# EAGLE design PCB (EAGLE 9.6.2)
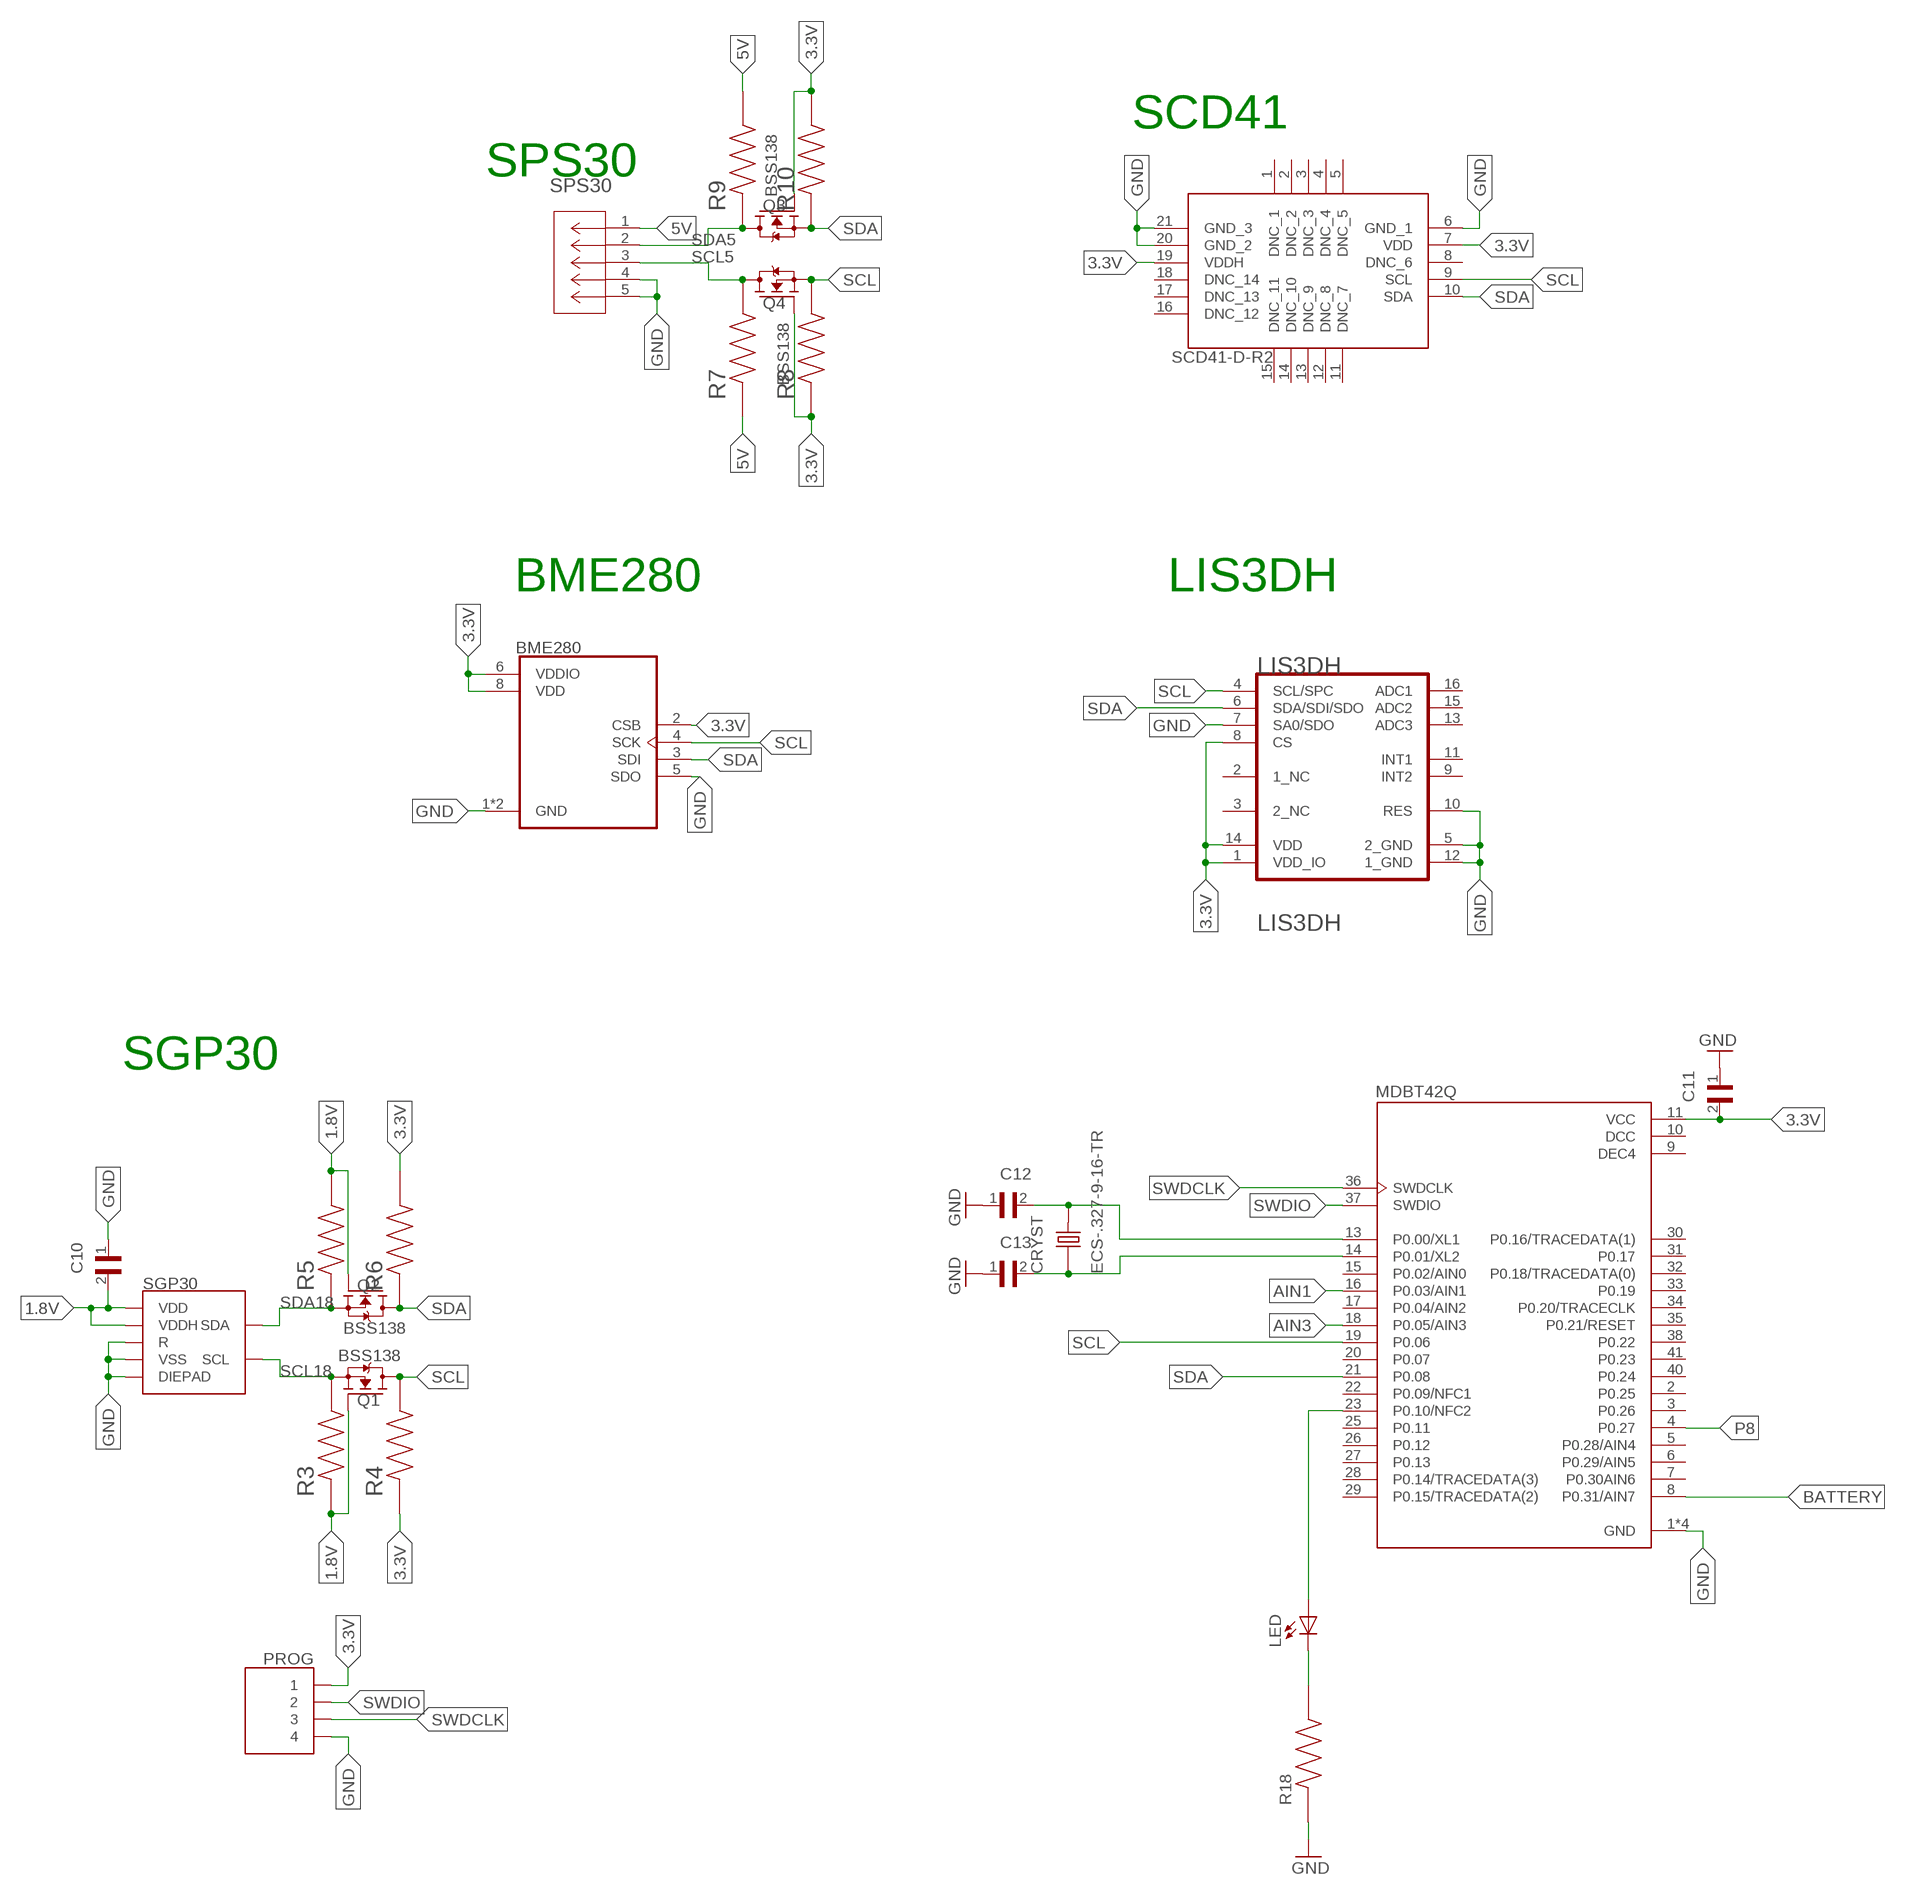
[diagram p0: schematic, sheet 1, part 1 of 2]
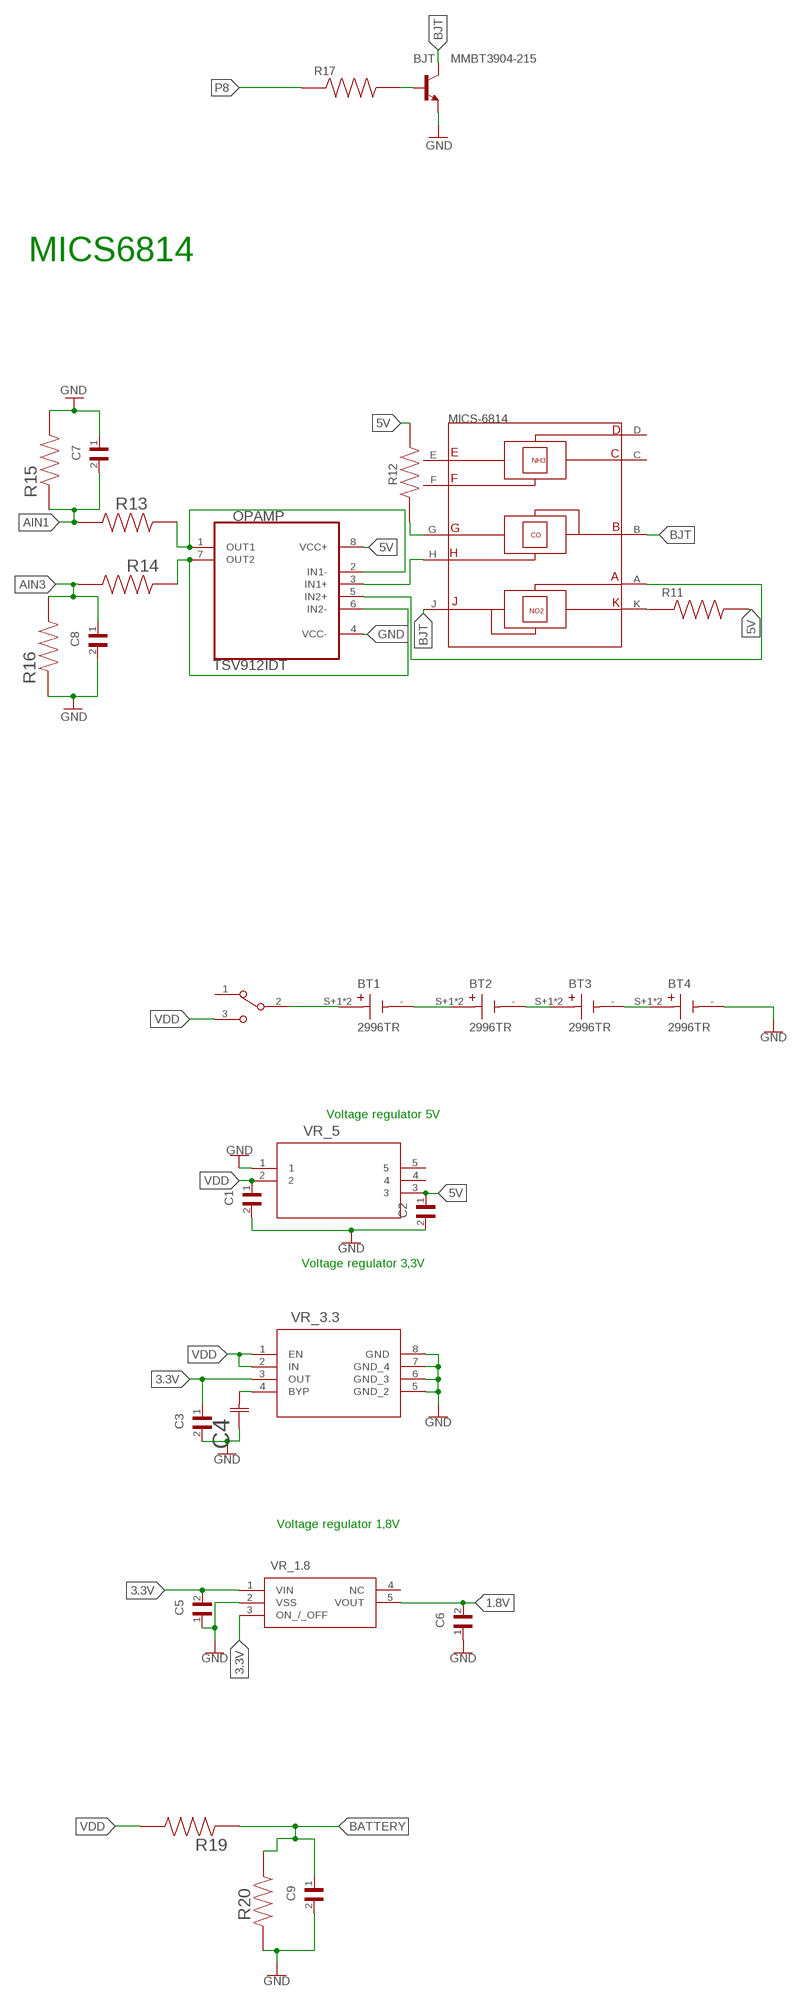
[diagram p1: schematic, sheet 1, part 2 of 2]

## Parts
BJT  MMBT3904-215  [SOT95P230X110-3N]
BME280  BME280  [PSON65P250X250X100-8N]
BT1  2996TR  [BAT_2996TR]
BT2  2996TR  [BAT_2996TR]
BT3  2996TR  [BAT_2996TR]
BT4  2996TR  [BAT_2996TR]
C1  C0402C104K9RACAUTO  [CAPC1005X55N]
C2  C0402C104K9RACAUTO  [CAPC1005X55N]
C3  CL05A225MQ5NNNC  [CAPC1005X55N]
C4  CL05B471KB5NNNCCAP_CL05_SAM  [CAP_CL05_SAM]
C5  JMK105BJ105KV-F  [CAPC1005X55N]
C6  JMK105BJ105KV-F  [CAPC1005X55N]
C7  CL05B103KO5NNNC  [CAPC1005X55N]
C8  CL05B103KO5NNNC  [CAPC1005X55N]
C9  CL05B103KO5NNNC  [CAPC1005X55N]
C10  C0402C104K9RACAUTO  [CAPC1005X55N]
C11  CL05A106MP5NUNC  [CAPC1005X55N]
C12  04025A120FAT2A  [CAPC1005X56N]
C13  04025A120FAT2A  [CAPC1005X56N]
CRYST  ECS-.327-9-16-TR  [XTAL_ECS-.327-9-16-TR]
LED  LTST-C170KRKT  [DIOC200X125X110]
LIS3DH  STMICROELECTRONICS_LIS3DHSTMICROELECTRONICS_LIS3DH_0_0  [STMICROELECTRONICS_LIS3DH_0]
MDBT42Q  317030213  [XCVR_317030213]
MICS6814  MICS-6814  [SENSOR_MICS-6814]
OPAMP  TSV912IDT  [SOIC127P600X175-8N]
PROG  BG306-04-A-1-0400-X-X_REVD  [GCT_BG306-04-A-1-0400-X-X_REVD]
Q1  BSS138  [SOT95P240X111-3N]
Q2  BSS138  [SOT95P240X111-3N]
Q3  BSS138  [SOT95P240X111-3N]
Q4  BSS138  [SOT95P240X111-3N]
R3  MCS0402MC1002FE000  [RESC1005X37N]
R4  MCS0402MC1002FE000  [RESC1005X37N]
R5  MCS0402MC1002FE000  [RESC1005X37N]
R6  MCS0402MC1002FE000  [RESC1005X37N]
R7  MCS0402MC1002FE000  [RESC1005X37N]
R8  MCS0402MC1002FE000  [RESC1005X37N]
R9  MCS0402MC1002FE000  [RESC1005X37N]
R10  MCS0402MC1002FE000  [RESC1005X37N]
R11  ERJPA2F1300X  [RES_ERJPA2F1300X]
R12  ERJPA2J821X  [RES_ERJPA2J821X]
R13  ERJ-2GEJ515X  [RESC1005X40N]
R14  ERJ-2GEJ515X  [RESC1005X40N]
R15  ERJ-2GEJ106X  [RESC1005X40N]
R16  ERJ-2GEJ106X  [RESC1005X40N]
R17  ERJPA2F5101X  [RES_ERJPA2F5101X]
R18  ERA2AEB331X  [RES_ERA2AEB331X]
R19  ERJ-2GEJ106X  [RESC1005X40N]
R20  ERJ-2GEJ106X  [RESC1005X40N]
S1  EG1213  [SW_EG1213]
SCD41  SCD41-D-R2  [SCD41DR2]
SGP30  SGP30  [SGP30]
SPS30  S5B-ZR-SM4A-TF_(LF)_(SN)CONN_S5B-ZR-SM4A-TF_JST  [CONN_S5B-ZR-SM4A-TF_JST]
VR_1.8  S-1318D18-M5T1U4  [SOT95P275X130-5N]
VR_3.3  MIC5219-3.3YMMMSOP-8LD-PL-1_MCH  [MSOP-8LD-PL-1_MCH]
VR_5  MC78LC50NTRGTSOT23-5_ONS  [TSOT23-5_ONS]

## Nets
1.8V: C6.2 C10.2 Q1.1(G) Q2.1(G) R3.1 R5.2 SGP30.1(VDD) SGP30.5(VDDH) VR_1.8.5(VOUT)
3.3V: BME280.2(CSB) BME280.6(VDDIO) BME280.8(VDD) C3.1 C5.2 C11.2 LIS3DH.1(VDD_IO) LIS3DH.8(CS) LIS3DH.14(VDD) MDBT42Q.11(VCC) PROG.1 Q3.1(G) Q4.1(G) R4.1 R6.2 R8.1 R10.2 SCD41.7(VDD) SCD41.19(VDDH) VR_1.8.1(VIN) VR_1.8.3(ON_/_OFF) VR_3.3.3(OUT)
5V: C2.1 OPAMP.8(VCC+) R7.1 R9.2 R11.2 R12.2 SPS30.1 VR_5.3
AIN1: C7.2 MDBT42Q.16(P0.03/AIN1) R13.1 R15.1
AIN3: C8.1 MDBT42Q.18(P0.05/AIN3) R14.1 R16.2
BATTERY: C9.1 MDBT42Q.8(P0.31/AIN7) R19.1 R20.1
BJT: BJT.3(C) MICS6814.B(RH1/RS1_RED) MICS6814.J(RH1/RS1_OX)
GND: BJT.2(E) BME280.1(GND) BME280.5(SDO) BME280.7(GND) BT4.- C1.2 C2.2 C3.2 C4.1 C5.1 C6.1 C7.1 C8.2 C9.2 C10.1 C11.1 C12.1 C13.1 LIS3DH.5(2_GND) LIS3DH.7(SA0/SDO) LIS3DH.10(RES) LIS3DH.12(1_GND) MDBT42Q.1(GND) MDBT42Q.12(GND) MDBT42Q.24(GND) MDBT42Q.39(GND) OPAMP.4(VCC-) PROG.4 R15.2 R16.1 R18.1 R20.2 SCD41.6(GND_1) SCD41.20(GND_2) SCD41.21(GND_3) SGP30.2(VSS) SGP30.4(R) SGP30.DIEPAD SPS30.4 SPS30.5 VR_1.8.2(VSS) VR_3.3.5(GND_2) VR_3.3.6(GND_3) VR_3.3.7(GND_4) VR_3.3.8(GND) VR_5.1
LED: LED.+ MDBT42Q.23(P0.10/NFC2)
N$2: BT1.- BT2.S+1(+) BT2.S+2(+)
N$3: MICS6814.A(RS2) OPAMP.5(IN2+)
N$4: BT2.- BT3.S+1(+) BT3.S+2(+)
N$7: OPAMP.6(IN2-) OPAMP.7(OUT2) R14.2
N$8: OPAMP.1(OUT1) OPAMP.2(IN1-) R13.2
N$9: LED.- R18.2
N$10: MICS6814.H(RS2_RED) OPAMP.3(IN1+)
N$11: MICS6814.G(RH2_RED) R12.1
N$13: MICS6814.K(RH2_OX) R11.1
N$14: C4.2 VR_3.3.4(BYP)
N$15: BJT.1(B) R17.2
N$17: C12.2 CRYST.2 MDBT42Q.13(P0.00/XL1)
N$18: C13.2 CRYST.1 MDBT42Q.14(P0.01/XL2)
N$25: BT3.- BT4.S+1(+) BT4.S+2(+)
N$27: BT1.S+1(+) BT1.S+2(+) S1.2
P8: MDBT42Q.4(P0.27) R17.1
SCL: BME280.4(SCK) LIS3DH.4(SCL/SPC) MDBT42Q.19(P0.06) Q1.3(D) Q4.2(S) R4.2 R8.2 SCD41.9(SCL)
SCL5: Q4.3(D) R7.2 SPS30.3
SCL18: Q1.2(S) R3.2 SGP30.6(SCL)
SDA: BME280.3(SDI) LIS3DH.6(SDA/SDI/SDO) MDBT42Q.21(P0.08) Q2.3(D) Q3.2(S) R6.1 R10.1 SCD41.10(SDA)
SDA5: Q3.3(D) R9.1 SPS30.2
SDA18: Q2.2(S) R5.1 SGP30.3(SDA)
SWDCLK: MDBT42Q.36(SWDCLK) PROG.3
SWDIO: MDBT42Q.37(SWDIO) PROG.2
VDD: C1.1 R19.2 S1.3 VR_3.3.1(EN) VR_3.3.2(IN) VR_5.2
Unconnected: LIS3DH.2(1_NC) LIS3DH.3(2_NC) LIS3DH.9(INT2) LIS3DH.11(INT1) LIS3DH.13(ADC3) LIS3DH.15(ADC2) LIS3DH.16(ADC1) MDBT42Q.2(P0.25) MDBT42Q.3(P0.26) MDBT42Q.5(P0.28/AIN4) MDBT42Q.6(P0.29/AIN5) MDBT42Q.7(P0.30AIN6) MDBT42Q.15(P0.02/AIN0) MDBT42Q.17(P0.04/AIN2) MDBT42Q.20(P0.07) MDBT42Q.22(P0.09/NFC1) MDBT42Q.25(P0.11) MDBT42Q.26(P0.12) MDBT42Q.27(P0.13) MDBT42Q.28(P0.14/TRACEDATA(3)) MDBT42Q.29(P0.15/TRACEDATA(2)) MDBT42Q.30(P0.16/TRACEDATA(1)) MDBT42Q.31(P0.17) MDBT42Q.32(P0.18/TRACEDATA(0)) MDBT42Q.33(P0.19) MDBT42Q.34(P0.20/TRACECLK) MDBT42Q.35(P0.21/RESET) MDBT42Q.38(P0.22) MDBT42Q.40(P0.24) MDBT42Q.41(P0.23) MICS6814.C(RH1_NH3) MICS6814.D(RS1_NH3) MICS6814.E(RH2_NH3) MICS6814.F(RS2_NH3) S1.1 SCD41.1(DNC_1) SCD41.2(DNC_2) SCD41.3(DNC_3) SCD41.4(DNC_4) SCD41.5(DNC_5) SCD41.8(DNC_6) SCD41.11(DNC_7) SCD41.12(DNC_8) SCD41.13(DNC_9) SCD41.14(DNC_10) SCD41.15(DNC_11) SCD41.16(DNC_12) SCD41.17(DNC_13) SCD41.18(DNC_14) VR_1.8.4(NC) VR_5.4 VR_5.5

## Notes on the sheet
- MICS6814
- SCD41
- SPS30
- BME280 | LIS3DH
- Voltage regulator 5V
- SGP30
- Voltage regulator 3,3V
- Voltage regulator 1,8V

## Power pins joined to a net without a drawn wire
DCC: MDBT42Q.10(DCC)
DEC4: MDBT42Q.9(DEC4)

## Library data of the parts
BJT = BJT_TO-236:MMBT3904-215: MMBT3904 series 40V 200mA SOT23 NPN Switching Transistor; DESCRIPTION: Bipolar (BJT) Transistor NPN 40 V 200 mA 300MHz 250 mW Surface Mount TO-236AB; DIGI-KEY_PART_NUMBER: 1727-4044-2-ND; MF: Nexperia USA; MP: MMBT3904,215; PACKAGE: SOT23-3 Nexperia USA Inc.; PURCHASE-URL: https://pricing.snapeda.com/search/part/MMBT3904,215/?ref=eda
BME280 = BME280:BME280: DIGITAL HUMIDITY, PRESSURE AND TEMPERATURE SENSOR * Digital interface I²C (up to 3.4 MHz) and SPI (3 and 4 wire, up to 10 MHz)* Supply voltage VDD main supply voltage range: 1.71 V to 3.6 V*VDDIO interface voltage range: 1.2 V to 3.6 V Operating range -40…+85 °C, 0…100 % rel. humidity, 300…1100 hPa The library has been designed by Richard Magdycz <https://www.facebook.com/groups/eaglecadsoftUK> Check availability <https://pricing.snapeda.com/parts/BME280/Bosch/view-part?ref=eda>; AVAILABILITY: In Stock; DESCRIPTION: Board Mount Humidity Sensors MEMS humidity, pressure and temperature sensor; MF: Bosch; MP: BME280; PACKAGE: LGA-8 Bosch; PRICE: None; PURCHASE-URL: https://pricing.snapeda.com/search/part/BME280/?ref=eda
BT1-BT4 = Battery_holder:2996TR: Battery Retainer Coin, 11.6mm 1 Cell SMD (SMT) Tab; DESCRIPTION: SMT Holder for 11.6mm Cell-Tin Nickel Plated on T&R; DIGI-KEY_PART_NUMBER: 36-2996TR-ND; MF: Keystone Electronics; MP: 2996TR; PACKAGE: None; PURCHASE-URL: https://pricing.snapeda.com/search/part/2996TR/?ref=eda
C1 C2 C10 = Cond_100n_0402:C0402C104K9RACAUTO: Cap Ceramic 0.1uF 6.3V X7R 10% SMD 0402 125°C Punched Paper T/R; DESCRIPTION: 0.1 µF ±10% 6.3V Ceramic Capacitor X7R 0402 (1005 Metric); DIGI-KEY_PART_NUMBER: 399-19367-2-ND; MF: KEMET; MP: C0402C104K9RACAUTO; PACKAGE: 0402 KEMET; PURCHASE-URL: https://pricing.snapeda.com/search/part/C0402C104K9RACAUTO/?ref=eda
C3 = Cond_2,2u_0402:CL05A225MQ5NNNC: KC 2,2µF 0402 20% 6,3V X5R; DESCRIPTION: 2.2 µF ±20% 6.3V Ceramic Capacitor X5R 0402 (1005 Metric); DIGI-KEY_PART_NUMBER: 1276-1469-2-ND; MF: Samsung; MP: CL05A225MQ5NNNC; PACKAGE: 0402 Samsung; PURCHASE-URL: https://pricing.snapeda.com/search/part/CL05A225MQ5NNNC/?ref=eda
C4 = Cond_470p_0402:CL05B471KB5NNNC; COPYRIGHT: Copyright (C) 2022 Ultra Librarian. All rights reserved.; DIGI-KEY_PART_NUMBER_1: 1276-1566-2-ND; DIGI-KEY_PART_NUMBER_2: 1276-1566-1-ND; DIGI-KEY_PART_NUMBER_3: 1276-1566-6-ND; MANUFACTURER_PART_NUMBER: CL05B471KB5NNNC; MFR_NAME: Samsung
C5 C6 = Cond_1u_0402:JMK105BJ105KV-F: Cap Ceramic 1uF 6.3V X5R 10% Pad SMD 0402 85°C T/R; DESCRIPTION: 1 µF ±10% 6.3V Ceramic Capacitor X5R 0402 (1005 Metric); DIGI-KEY_PART_NUMBER: 587-1231-2-ND; MF: Taiyo Yuden; MP: JMK105BJ105KV-F; PACKAGE: 1005 Taiyo Yuden; PURCHASE-URL: https://pricing.snapeda.com/search/part/JMK105BJ105KV-F/?ref=eda
C7-C9 = Cond_10n_0402:CL05B103KO5NNNC: Cap Ceramic 0.01uF 16V X7R 10% SMD 0402 125°C Paper T/R; DESCRIPTION: 10000 pF ±10% 16V Ceramic Capacitor X7R 0402 (1005 Metric); DIGI-KEY_PART_NUMBER: 1276-1051-2-ND; MF: Samsung Electro-Mechanics; MP: CL05B103KO5NNNC; PACKAGE: 0402 Samsung; PURCHASE-URL: https://pricing.snapeda.com/search/part/CL05B103KO5NNNC/?ref=eda
C11 = Cond_10u_0402:CL05A106MP5NUNC: Cap Ceramic 10uF 10V X5R 20% SMD 0402 85C T/R; DESCRIPTION: 10 µF ±20% 10V Ceramic Capacitor X5R 0402 (1005 Metric); DIGI-KEY_PART_NUMBER: 1276-1450-2-ND; MF: Samsung; MP: CL05A106MP5NUNC; PACKAGE: 0402 Samsung; PURCHASE-URL: https://pricing.snapeda.com/search/part/CL05A106MP5NUNC/?ref=eda
C12 C13 = Cond_12p_0402:04025A120FAT2A: Cap Ceramic 12pF 50V C0G 1% SMD 0402 125°C Paper T/R; DESCRIPTION: 12 pF ±1% 50V Ceramic Capacitor C0G, NP0 0402 (1005 Metric); DIGI-KEY_PART_NUMBER: 478-10087-2-ND; MF: AVX; MP: 04025A120FAT2A; PACKAGE: 1005 AVX; PURCHASE-URL: https://pricing.snapeda.com/search/part/04025A120FAT2A/?ref=eda
CRYST = Crystal-ECS-.327-9-16-TR:ECS-.327-9-16-TR: SMD Tuning Fork Crystal; DESCRIPTION: 32.768 kHz ±20ppm Crystal 9pF 90 kOhms 2-SMD, No Lead; DIGI-KEY_PART_NUMBER: XC2132TR-ND; MF: ECS Inc.; MP: ECS-.327-9-16-TR; PACKAGE: SMD-2 ECS International; PURCHASE-URL: https://pricing.snapeda.com/search/part/ECS-.327-9-16-TR/?ref=eda
LED = LED_R_LTST-C170KRKT:LTST-C170KRKT: Green 2 x 1.25 x 1.1 mm 130° Water Clear 35 mcd 2 V Surface Mount LED; DESCRIPTION: Red 631nm LED Indication - Discrete 2V 0805 (2012 Metric); DIGI-KEY_PART_NUMBER: 160-1415-2-ND; MF: Lite-On Inc.; MP: LTST-C170KRKT; PACKAGE: None; PURCHASE-URL: https://pricing.snapeda.com/search/part/LTST-C170KRKT/?ref=eda
LIS3DH = STMicroelectronics - LIS3DH:STMICROELECTRONICS_LIS3DH: STM-LIS3DH-LGA-16; BANDWIDTH: 5 kHz; CIIVA_IDS: 978556; COMPONENT_LINK_1_DESCRIPTION: Manufacturer URL; COMPONENT_LINK_1_URL: http://www.st.com/; COMPONENT_LINK_3_DESCRIPTION: Package Specification; COMPONENT_LINK_3_URL: http://www.st.com/st-web-ui/static/active/en/resource/technical/document/datasheet/CD00274221.pdf; CURRENT_CONSUMPTION_IN_POWER_DOWN_MODE: 0.5 uA; DATASHEET: http://www.st.com/st-web-ui/static/active/en/resource/technical/document/datasheet/CD00274221.pdf; DATASHEET_VERSION: Rev. 1; FOOTPRINT_VARIANT_NAME_0: Manufacturer Recommended; IMPORTED: yes; IMPORTED_FROM: vault; IMPORT_TS: 1521860055; INTERFACE: I2C, SPI; MF: STMicroelectronics; MOUNTING_TECHNOLOGY: Surface Mount; MPN: LIS3DH; OPERATING_TEMPERATURE: -40 to 85 degC; OUTPUT_TYPE: Digital; PACKAGE: LGA-16; PACKAGE_DESCRIPTION: 16-Pin Land Grid Array, Body 3 x 3 mm, Pitch 0.5 mm; PACKING: Tray; PIN_0_0_3_INSIDE_EDGE: clock; PREFIX: U; RELEASE_DATE: 1506332602; ROHS: Yes; VAULT_GUID: 35EBCE1D-2944-446E-95F1-4BAFD91B2D9D; VAULT_REVISION: 2E44ACB8-410E-4D5A-8B6F-2E9483856AF3; WIDE_SUPPLY_VOLTAGE: 1.71 to 3.6 V
MDBT42Q = Raytac_nRF52:317030213: Mdbt42q Nrf52832 Based BLE Module; DESCRIPTION: Bluetooth Bluetooth v4.2 Transceiver Module 2.4GHz Integrated, Chip Surface Mount; DIGI-KEY_PART_NUMBER: 1597-1434-ND; MF: Seeed Technology; MP: 317030213; PACKAGE: SMD-41 Seeed Studio; PURCHASE-URL: https://pricing.snapeda.com/search/part/317030213/?ref=eda
MICS6814 = MICS-6814:MICS-6814: Three gas SMD NH3, CO and NO2 Check availability <https://pricing.snapeda.com/parts/MICS-6814/MikroElektronika/view-part?ref=eda>; AVAILABILITY: Not in stock; DESCRIPTION: MiCS-6814 Air Quality Sensor mikroBUS™ Click™ Platform Evaluation Expansion Board; MF: MikroElektronika; MP: MICS-6814; PACKAGE: None; PRICE: None
OPAMP = Opamp_SMD:TSV912IDT: operational amplifiers Check availability <https://pricing.snapeda.com/parts/TSV912IDT/STMicroelectronics/view-part?ref=eda>; AVAILABILITY: In Stock; DESCRIPTION: General Purpose Amplifier 2 Circuit Rail-to-Rail 8-SOIC; MF: STMicroelectronics; MP: TSV912IDT; PACKAGE: SOIC-8 STMicroelectronics; PRICE: None; PURCHASE-URL: https://pricing.snapeda.com/search/part/TSV912IDT/?ref=eda
PROG = Connet_6_BG306-04-A-1-0400-X-X_REVD:BG306-04-A-1-0400-X-X_REVD: 2.54mm Pitch Pin Socket,Single Row Vertical, Top Entry, Surface Mount, Natural LCP; DESCRIPTION: 4 Position Receptacle Connector 0.100 (2.54mm) Surface Mount Gold; DIGI-KEY_PART_NUMBER: 2073-BG306-04-A-1-0400-L-BTR-ND; MF: Global Connector Technology; MP: BG306-04-A-1-0400-L-B; PACKAGE: None; PURCHASE-URL: https://pricing.snapeda.com/search/part/BG306-04-A-1-0400-L-B/?ref=eda
Q1-Q4 = BSS138:BSS138: N-Channel 50V 220mA (Ta) 360mW (Ta) Surface Mount SOT-23-3; DESCRIPTION: N-Channel 50 V 200mA (Ta) 225mW (Ta) Surface Mount SOT-23-3 (TO-236); DIGI-KEY_PART_NUMBER: BSS138TR-ND; MF: ON Semiconductor; MP: BSS138; PACKAGE: SOT-23 ON; PURCHASE-URL: https://pricing.snapeda.com/search/part/BSS138/?ref=eda
R3-R10 = Res_10K_0402:MCS0402MC1002FE000: Res Thin Film 0402 10K Ohm 1% 1/10W ±50ppm/°C Molded SMD Paper T/R; DESCRIPTION: 10 kOhms ±1% 0.1W, 1/10W Chip Resistor 0402 (1005 Metric) Anti-Sulfur, Automotive AEC-Q200 Thin Film; DIGI-KEY_PART_NUMBER: MCS0402-10.0K-MFTR-ND; MF: Vishay Beyschlag; MP: MCS0402MC1002FE000; PACKAGE: 1005 Vishay; PURCHASE-URL: https://pricing.snapeda.com/search/part/MCS0402MC1002FE000/?ref=eda
R11 = Res_130_0402:ERJPA2F1300X; DESCRIPTION: 130 Ohms ±1% 0.2W, 1/5W Chip Resistor 0402 (1005 Metric) Automotive AEC-Q200, Pulse Withstanding Thick Film; DIGI-KEY_PART_NUMBER: P124437TR-ND; MF: Panasonic; MP: ERJPA2F1300X; PACKAGE: 1005-2 Panasonic; PURCHASE-URL: https://pricing.snapeda.com/search/part/ERJPA2F1300X/?ref=eda
R12 = Res_820_0402:ERJPA2J821X; DESCRIPTION: Res Thick Film 0402 820 Ohm 5% 0.2W(1/5W) ±200ppm/°C Pad SMD Automotive T/R; DIGI-KEY_PART_NUMBER: P124598TR-ND; MF: Panasonic; MP: ERJPA2J821X; PACKAGE: 1005-2 Panasonic; PURCHASE-URL: https://pricing.snapeda.com/search/part/ERJPA2J821X/?ref=eda
R13 R14 = Res_5,1M_0402:ERJ-2GEJ515X: RES, THICK FILM, 5M1, 5%, 0.1W, 0402; DESCRIPTION: 5.1 MOhms ±5% 0.1W, 1/10W Chip Resistor 0402 (1005 Metric) Automotive AEC-Q200 Thick Film; DIGI-KEY_PART_NUMBER: P5.1MJTR-ND; MF: Panasonic; MP: ERJ-2GEJ515X; PACKAGE: 1005 Panasonic Electronic Components; PURCHASE-URL: https://pricing.snapeda.com/search/part/ERJ-2GEJ515X/?ref=eda
R15 R16 R19 R20 = Res_10M_0402:ERJ-2GEJ106X: Res Thick Film 0402 10M Ohm 5% 0.1W(1/10W) -400ppm/C to 150ppm/C Pad SMD Automotive T/R; DESCRIPTION: Res Thick Film 0402 10M Ohm 5% 1/10W -400ppm/°C to 150ppm/°C Molded SMD Punched Carrier T/R; DIGI-KEY_PART_NUMBER: P10MJTR-ND; MF: Panasonic Electronic; MP: ERJ-2GEJ106X; PACKAGE: 1005 Panasonic Electronic Components; PURCHASE-URL: https://pricing.snapeda.com/search/part/ERJ-2GEJ106X/?ref=eda
R17 = Res_5,1K_0402:ERJPA2F5101X; DESCRIPTION: 5.1 kOhms ±1% 0.2W, 1/5W Chip Resistor 0402 (1005 Metric) Automotive AEC-Q200, Pulse Withstanding Thick Film; DIGI-KEY_PART_NUMBER: P124488TR-ND; MF: Panasonic; MP: ERJPA2F5101X; PACKAGE: 1005-2 Panasonic; PURCHASE-URL: https://pricing.snapeda.com/search/part/ERJPA2F5101X/?ref=eda
R18 = Res_330_0402:ERA2AEB331X; DESCRIPTION: 330 Ohms ±0.1% 0.063W, 1/16W Chip Resistor 0402 (1005 Metric) Automotive AEC-Q200 Thin Film; DIGI-KEY_PART_NUMBER: P330DCTR-ND; MF: Panasonic; MP: ERA2AEB331X; PACKAGE: 1005-2 Panasonic
S1 = switch_TH_HO:EG1213: EG Series SPDT On-On Right Angle Through Hole Slide Switch; DESCRIPTION: Slide Switch SPDT Through Hole, Right Angle; DIGI-KEY_PART_NUMBER: EG1906-ND; MF: E-Switch; MP: EG1213; PACKAGE: None; PURCHASE-URL: https://pricing.snapeda.com/search/part/EG1213/?ref=eda
SCD41 = SCD41-R2_unofficial:SCD41-D-R2: Air Quality Sensor CO2 Sensor 2.5V/3.3V/5V 20-Pin SMD EP Source: Datasheet <https://cz.mouser.com/datasheet/2/682/Sensirion_CO2_Sensors_SCD4x_Datasheet-2010009.pdf>; ARROW_PART_NUMBER: SCD41-D-R2; ARROW_PRICE-STOCK: https://www.arrow.com/en/products/scd41-d-r2/sensirion-ag?region=nac; DESCRIPTION: Air Quality Sensor CO2 Sensor 2.5V/3.3V/5V 20-Pin SMD EP; HEIGHT: 6.8mm; MANUFACTURER_NAME: Sensirion; MANUFACTURER_PART_NUMBER: SCD41-D-R2; MOUSER_PART_NUMBER: 403-SCD41-D-R2; MOUSER_PRICE-STOCK: https://www.mouser.co.uk/ProductDetail/Sensirion/SCD41-D-R2?qs=HBWAp0VN4Ri4o7ei4T3s0g%3D%3D
SGP30 = SGP30:SGP30: The SGP30 is a digital multi-pixel gas sensor designed for easy integration into air purifier, demand-controlled ventilation, and IoT applications. Check availability <https://pricing.snapeda.com/parts/SGP30/Sensirion%20AG/view-part?ref=eda>; AVAILABILITY: In Stock; DESCRIPTION: SGP30, SHTC1 Air Quality, Humidity, Temperature Sensor Arduino Platform Evaluation Expansion Board; MF: Sensirion AG; MP: SGP30; PACKAGE: None; PRICE: None; PURCHASE-URL: https://pricing.snapeda.com/search/part/SGP30/?ref=eda
SPS30 = CONN_SMD_5PIN:S5B-ZR-SM4A-TF_(LF)_(SN); COPYRIGHT: Copyright (C) 2022 Ultra Librarian. All rights reserved.; DIGI-KEY_PART_NUMBER_1: 455-1696-2-ND; DIGI-KEY_PART_NUMBER_2: 455-1696-1-ND; DIGI-KEY_PART_NUMBER_3: 455-1696-6-ND; MANUFACTURER_PART_NUMBER: S5B-ZR-SM4A-TF (LF) (SN); MFR_NAME: JST
VR_1.8 = VOLT_REG_1.8_SOT-23-5:S-1318D18-M5T1U4: IC REG LINEAR 1.8V 100MA SOT23-5 Source: Datasheet <https://www.ablic.com/en/doc/datasheet/voltage_regulator/S1318_E.pdf>; DESCRIPTION: IC REG LINEAR 1.8V 100MA SOT23-5; HEIGHT: 1.3mm; MANUFACTURER_NAME: ABLIC Inc.; MANUFACTURER_PART_NUMBER: S-1318D18-M5T1U4; MOUSER_PART_NUMBER: 628-S-1318D18-M5T1U4; MOUSER_PRICE-STOCK: https://www.mouser.co.uk/ProductDetail/ABLIC/S-1318D18-M5T1U4/?qs=bZr6mbWTK5mVILZBDijY2w%3D%3D
VR_3.3 = Volt_Reg_3.3_8MSOP:MIC5219-3.3YMM; COPYRIGHT: Copyright (C) 2022 Ultra Librarian. All rights reserved.; DIGI-KEY_PART_NUMBER_1: 576-1827-5-ND; MANUFACTURER_PART_NUMBER: MIC5219-3.3YMM; MFR_NAME: Microchip
VR_5 = VOLT_REG_5V_SOT-23-5:MC78LC50NTRG; COPYRIGHT: Copyright (C) 2022 Ultra Librarian. All rights reserved.; DIGI-KEY_PART_NUMBER_1: 2156-MC78LC50NTRG-OS-ND; DIGI-KEY_PART_NUMBER_2: =MC78LC50NTRG; DIGI-KEY_PART_NUMBER_3: MC78LC50NTRGOSCT-ND; DIGI-KEY_PART_NUMBER_4: MC78LC50NTRGOSDKR-ND; DIGI-KEY_PART_NUMBER_5: MC78LC50NTRGOSTR-ND; MANUFACTURER_PART_NUMBER: MC78LC50NTRG; MFR_NAME: onsemi

## Board
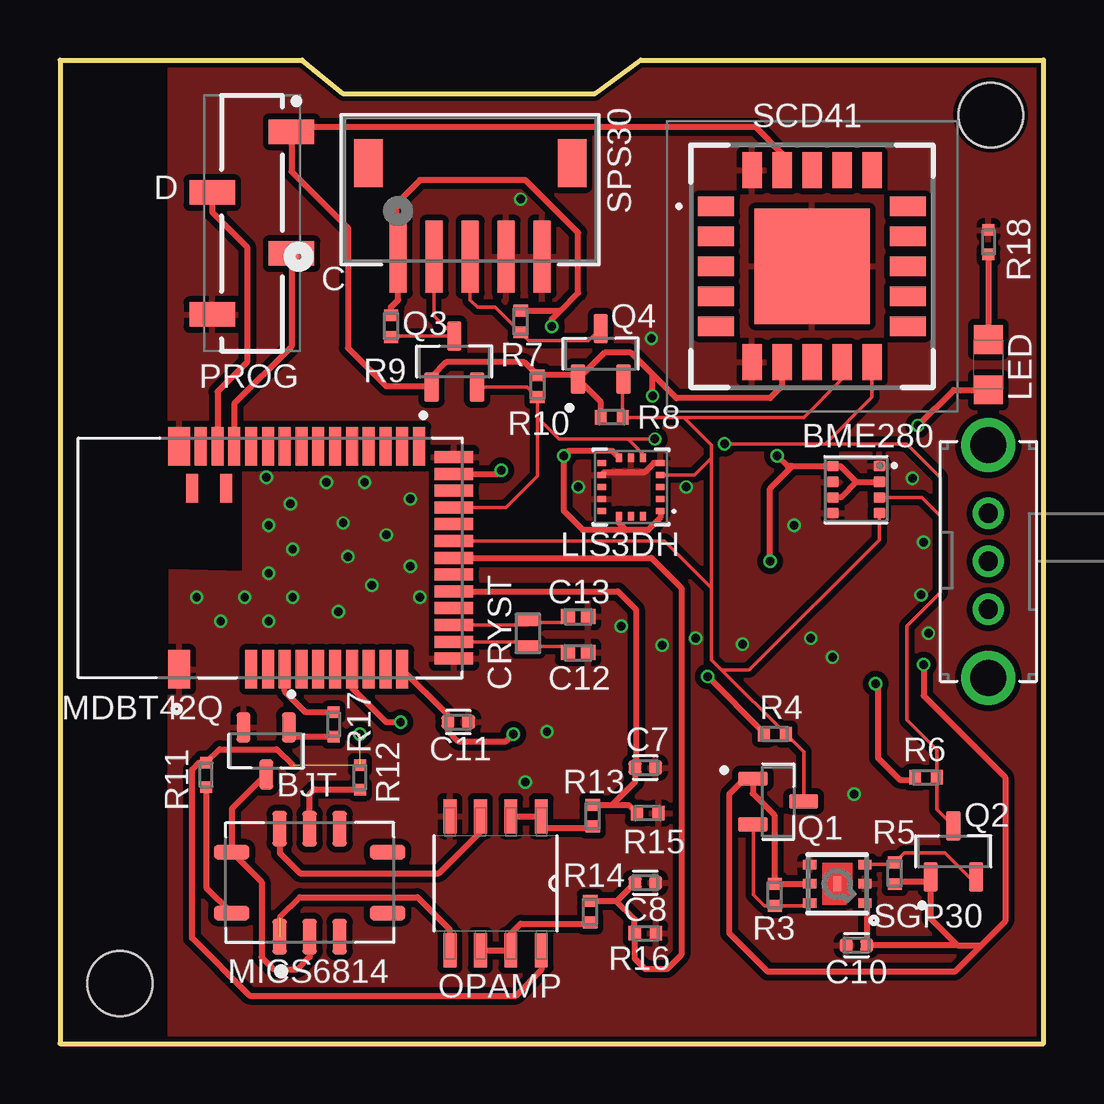
[diagram p2: board, top side]
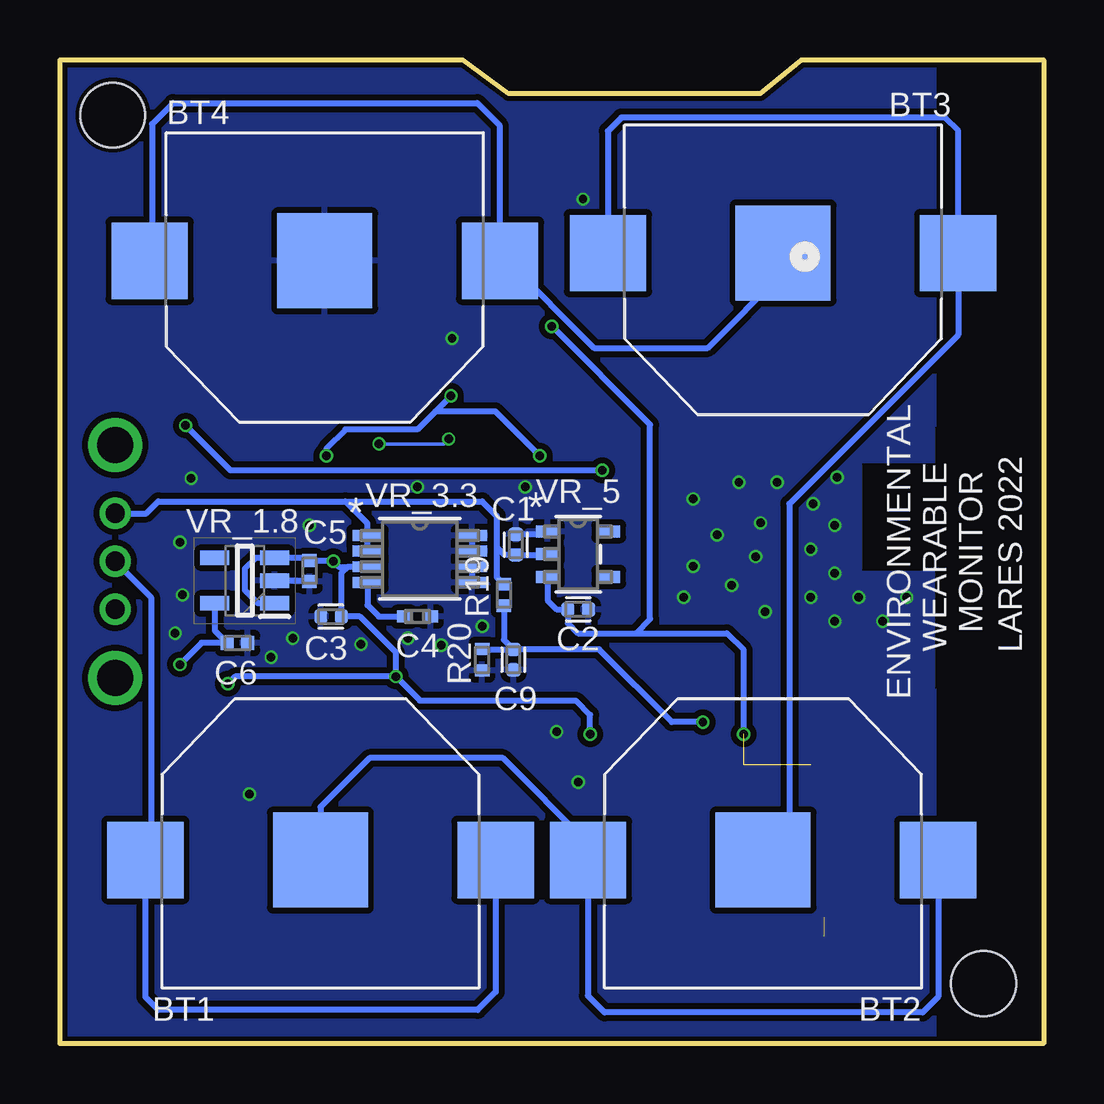
[diagram p3: board, bottom side, seen from below]

Size 41 x 41 mm. Coordinates in mm from the lower left corner, seen from the top.
Outline: 0,41 0,0 41,0 41,41 24.2,41 22.3,39.6 11.8,39.6 10.1,41 0,41
Copper layers (1+2*15+16): Top 0.035mm / dielectric 0.18mm / layer 2 0.017mm / dielectric 1.12mm / layer 15 0.017mm / dielectric 0.18mm / Bottom 0.035mm
Design rules "DRC May 2022": minimum track width 3.5mil, minimum drill 0.35mm, track to track 0.25mm, track to pad 0.14mm, pad to pad 0.14mm, via to via 0.14mm, smd to smd 0.14mm, copper to edge 0.201mm, drill to drill 6mil, minimum pad ring 10mil, minimum via ring 0.1mm, stop-mask expansion 0.014mm, vias tented up to drill 1mm, thermal gap 10mil
Holes 2.7 mm at 2.5,2.5 38.8,38.7

### Footprints (pad centres in the part's own frame; a part is rotated, then mirrored left to right if it is on the bottom)
SOT95P230X110-3N = smd 1.26 x 0.59: 1 -0.98,0.95; 2 -0.98,-0.95; 3 0.98,0
PSON65P250X250X100-8N = smd 0.49 x 0.45: 1 0.97,0.975; 2 0.97,0.325; 3 0.97,-0.325; 4 0.97,-0.975; 5 -0.97,-0.975; 6 -0.97,-0.325; 7 -0.97,0.325; 8 -0.97,0.975
BAT_2996TR = smd 3.96 x 3.96: - 0,0 | smd 3.18 x 3.18: S+1 -7.3,0; S+2 7.3,0
CAPC1005X55N = smd 0.54 x 0.6: 1 -0.43,0; 2 0.43,0
CAP_CL05_SAM = smd 0.606 x 0.5: 1 -0.553,0; 2 0.553,0
CAPC1005X55N' = smd 0.54 x 0.6: 1 -0.432,0; 2 0.432,0
CAPC1005X56N = smd 0.59 x 0.63: 1 -0.42,0; 2 0.42,0
XTAL_ECS-.327-9-16-TR = smd 0.5 x 1: 1 -0.55,0; 2 0.55,0
DIOC200X125X110 = smd 1.2 x 1.2: + 1.05,0; - -1.05,0
STMICROELECTRONICS_LIS3DH_0 = smd 0.35 x 0.25: 1 -1.225,1; 2 -1.225,0.5; 3 -1.225,0; 4 -1.225,-0.5; 5 -1.225,-1; 9 1.225,-1; 10 1.225,-0.5; 11 1.225,0; 12 1.225,0.5; 13 1.225,1 | smd 0.25 x 0.35: 6 -0.5,-1.225; 7 0,-1.225; 8 0.5,-1.225; 14 0.5,1.225; 15 0,1.225; 16 -0.5,1.225
XCVR_317030213 = smd 1.6 x 0.9: 1 -4.65,3.8; 39 4.65,3.8 | smd 1.6 x 0.5: 2 -4.65,0.8; 3 -4.65,0.1; 4 -4.65,-0.6; 5 -4.65,-1.3; 6 -4.65,-2; 7 -4.65,-2.7; 8 -4.65,-3.4; 9 -4.65,-4.1; 10 -4.65,-4.8; 11 -4.65,-5.5; 25 4.65,-6.2; 26 4.65,-5.5; 27 4.65,-4.8; 28 4.65,-4.1; 29 4.65,-3.4; 30 4.65,-2.7; 31 4.65,-2; 32 4.65,-1.3; 33 4.65,-0.6; 34 4.65,0.1; 35 4.65,0.8; 36 4.65,1.5; 37 4.65,2.2; 38 4.65,2.9 | smd 0.5 x 1.6: 12 -4.2,-7.65; 13 -3.5,-7.65; 14 -2.8,-7.65; 15 -2.1,-7.65; 16 -1.4,-7.65; 17 -0.7,-7.65; 18 0,-7.65; 19 0.7,-7.65; 20 1.4,-7.65; 21 2.1,-7.65; 22 2.8,-7.65; 23 3.5,-7.65; 24 4.2,-7.65 | smd 1.2 x 0.5: 40 2.9,3.25; 41 2.9,1.85
SENSOR_MICS-6814 = smd 1.5 x 0.6: A -2.25,1.25; B -2.25,0; C -2.25,-1.25; F 2.25,-1.25; G 2.25,0; H 2.25,1.25 | smd 0.6 x 1.5: D -1.27,-3.25; E 1.27,-3.25; J 1.27,3.25; K -1.27,3.25
SOIC127P600X175-8N = smd 1.422 x 0.533: 1 -2.794,1.905; 2 -2.794,0.635; 3 -2.794,-0.635; 4 -2.794,-1.905; 5 2.794,-1.905; 6 2.794,-0.635; 7 2.794,0.635; 8 2.794,1.905
GCT_BG306-04-A-1-0400-X-X_REVD = smd 1.02 x 1.9: 1 -3.81,1.65; 2 -1.27,-1.65; 3 1.27,1.65; 4 3.81,-1.65
SOT95P240X111-3N = smd 1.23 x 0.6: 1 -1.06,0.95; 2 -1.06,-0.95; 3 1.06,0
RESC1005X37N = smd 0.49 x 0.6: 1 -0.457,0; 2 0.457,0
RES_ERJPA2F1300X = smd 0.475 x 0.5: 1 -0.512,0; 2 0.512,0
RES_ERJPA2J821X = smd 0.475 x 0.5: 1 -0.512,0; 2 0.512,0
RESC1005X40N = smd 0.51 x 0.6: 1 -0.445,0; 2 0.445,0
RES_ERJPA2F5101X = smd 0.475 x 0.5: 1 -0.512,0; 2 0.512,0
RES_ERA2AEB331X = smd 0.475 x 0.5: 1 -0.512,0; 2 0.512,0
SW_EG1213 = drill 0.8: 1 -2,0; 2 0,0; 3 2,0 | drill 1.5: P$4 -4.85,0; P$5 4.85,0
SCD41DR2 = smd 1.5 x 0.8: 1 -4,2.5; 2 -4,1.25; 3 -4,0; 4 -4,-1.25; 5 -4,-2.5; 11 4,-2.5; 12 4,-1.25; 13 4,0; 14 4,1.25; 15 4,2.5 | smd 0.8 x 1.5: 6 -2.5,-4; 7 -1.25,-4; 8 0,-4; 9 1.25,-4; 10 2.5,-4; 16 2.5,4; 17 1.25,4; 18 0,4; 19 -1.25,4; 20 -2.5,4 | smd 4.8 x 4.8: 21 0,0
SGP30 = smd 0.55 x 0.4: 1 -1.15,0.8; 2 -1.15,0; 3 -1.15,-0.8; 4 1.15,-0.8; 5 1.15,0; 6 1.15,0.8 | smd 0.305 x 0.61: DIEPAD 0,0
CONN_S5B-ZR-SM4A-TF_JST = smd 0.711 x 2.997: 1 0,0; 2 1.5,0; 3 3,0; 4 4.5,0; 5 6,0 | smd 1.194 x 2.007: 6 -1.25,3.902; 7 7.25,3.902
SOT95P275X130-5N = smd 1.2 x 0.6: 1 -1.25,0.95; 2 -1.25,0; 3 -1.25,-0.95; 4 1.25,-0.95; 5 1.25,0.95
MSOP-8LD-PL-1_MCH = smd 1.257 x 0.457: 1 -2.178,0.975; 2 -2.178,0.325; 3 -2.178,-0.325; 4 -2.178,-0.975; 5 2.178,-0.975; 6 2.178,-0.325; 7 2.178,0.325; 8 2.178,0.975
TSOT23-5_ONS = smd 0.953 x 0.508: 1 -1.276,0.95; 2 -1.276,0; 3 -1.276,-0.95; 4 1.276,-0.95; 5 1.276,0.95

### Placement (x,y rotation side)
BJT  8.6,12.2 270 top
BME280  33.18,23.09 0 top
BT1  30.14,7.65 180 bottom
BT2  11.69,7.65 180 bottom
BT3  10.86,32.95 0 bottom
BT4  29.96,32.63 0 bottom
C1  22,20.8 90 bottom
C2  19.4,18.1 0 bottom
C3  29.7,17.8 180 bottom
C4  26.1,17.8 180 bottom
C5  JMK105BJ105KV-F  [CAPC1005X55N']  30.6,19.7 90 bottom
C6  JMK105BJ105KV-F  [CAPC1005X55N']  33.6,16.7 180 bottom
C7  24.4,11.5 180 top
C8  24.4,6.7 0 top
C9  22.1,16 270 bottom
C10  33.2,4.1 0 top
C11  16.6,13.4 180 top
C12  21.6,16.3 180 top
C13  21.6,17.8 180 top
CRYST  19.5,17.1 270 top
LED  38.7,28.3 270 top
LIS3DH  23.8,23.2 180 top
MDBT42Q  8.77,20.25 90 top
MICS6814  10.41,6.71 90 top
OPAMP  18.16,6.68 270 top
PROG  8,34.2 270 top
Q1  29.94,10.09 0 top
Q2  37.24,8.01 90 top
Q3  16.44,28.43 90 top
Q4  22.54,28.75 90 top
R3  29.8,6.2 270 top
R4  29.8,12.9 0 top
R5  34.8,7.1 270 top
R6  36.1,11.1 180 top
R7  19.2,30.1 270 top
R8  23,26.1 0 top
R9  13.8,29.9 90 top
R10  19.9,27.4 90 top
R11  6.1,11.2 90 top
R12  12.5,11.1 90 top
R13  22.2,9.5 270 top
R14  22.1,5.5 270 top
R15  24.5,9.6 0 top
R16  24.4,4.6 180 top
R17  11.4,13.3 270 top
R18  38.7,33.4 270 top
R19  22.5,18.7 90 bottom
R20  23.4,16 270 bottom
S1  38.7,20.1 90 top
SCD41  31.35,32.4 0 top
SGP30  32.4,6.66 180 top
SPS30  14.1,32.8 0 top
VR_1.8  33.3,19.3 180 bottom
VR_3.3  26,20.2 0 bottom
VR_5  19.4,20.4 0 bottom

### Tracks (layer width: path | path; a pad name or v marks a point on that pad's centre or on a via)
1.8V  (via drill 0.35)
  Top 0.254: v36,15.8 36,14.5 39.4,11.1 39.4,5.1 38.4,4.1 | 37.4,4.1 C10.2 33.63,5.78 SGP30.1 | R5.2 34.9,6.74 36.08,6.74 Q2.1 36.29,5.21 37.4,4.1 | 38.4,4.1 37.3,3 29.5,3 27.9,4.6 27.9,10.4 28.54,11.04 Q1.1 28.88,10.42 29.77,9.53 29.77,6.68 R3.1 SGP30.5 | 37.4,4.1 38.4,4.1
  Bottom 0.254: VR_1.8.5 34.55,17.22 C6.2 35.1,16.7 v36,15.8
3.3V  (via drill 0.35)
  Top 0.254: v18.9,12.9 18.6,12.6 16.6,12.6 16.17,13.03 C11.2 16.17,13.7 MDBT42Q.11 | R6.2 35.54,11 35,11 34.1,11.9 34.1,14.9 v34,15 | R4.1 29.34,12.96 v27,15.3 | SCD41.19 30.1,37.1 29,38.2 9.65,38.2 PROG.1 9.65,36.35 12,34 12,29 13.6,27.4 15.46,27.4 Q3.1 15.49,27.79 16.1,28.4 19.36,28.4 R10.2 21.42,27.86 Q4.1 | 23.6,21.4 24.5,21.4 25.02,21.93 LIS3DH.1 | 23.6,21.4 23.3,21.7 LIS3DH.14 | 23.6,21.4 21.8,21.4 21,22.2 v21,24.5 21.2,24.7 23.02,24.7 LIS3DH.8 | Q4.1 22.7,28.8 23.8,28.8 24.7,27.9 | Q4.1 22.54,26.74 R8.1 | 30.53,24.06 BME280.8 32.53,24.06 33.2,23.4 | 33.2,23.4 32.56,22.77 BME280.6 | 33.2,23.4 34.13,23.4 BME280.2 | SCD41.7 30.1,27.4 29.6,26.9 25.7,26.9 24.7,27.9 | v24.7,27 24.7,27.9 | 30.53,24.06 29.6,23.13 v29.6,20.1 | 30.53,24.06 30.34,24.06 v29.9,24.5
  Bottom 0.254: v27,15.3 26,14.3 19.5,14.3 18.9,13.7 v18.9,12.9 | v27,15.3 27,16.3 28.5,17.8 C3.1 29.27,19.6 29,19.88 | VR_3.3.3 29,19.88 | 29,19.88 29.38,19.88 v29.6,20.1 29.63,20.13 C5.2 30.72,20.25 VR_1.8.3 32.85,20.25 33.3,19.8 33.3,18.9 32.75,18.35 VR_1.8.1 | v27,15.3 33.7,15.3 v34,15 | v24.7,27 25.35,26.35 | 25.35,26.35 26.1,25.6 29.1,25.6 29.9,24.8 v29.9,24.5 | v21,24.5 22.85,26.35 25.35,26.35
5V  (via drill 0.35)  (2 unrouted)
  Top 0.254: 9.69,11.61 9.03,12.27 6.66,12.27 R11.2 5.8,11.71 5.5,11.41 5.5,4.4 7.9,2 19,2 20.07,3.07 OPAMP.8 | R9.2 13.8,30.7 14.1,31 SPS30.1 14,32.9 14,35 15,36 19.4,36 21.6,33.8 21.6,31.3 20.86,30.56 | R7.1 20.86,30.56 | v20.5,29.9 20.5,30.2 20.86,30.56
  Bottom 0.254: v12.5,12.9 12.5,16.4 13.2,17.1 17,17.1 | VR_5.3 20.68,18.48 20.3,18.1 C2.1 19.83,17.53 19.4,17.1 17,17.1 | 17,17.1 16.4,17.7 16.4,25.8 v20.5,29.9
AIN1
  Top 0.254: MDBT42Q.16 23.25,18.85 24,18.1 24,11.53 C7.2 23.97,10.91 23.01,9.95 | R13.1 23.01,9.95 | 23.01,9.95 23.71,9.95 R15.1
AIN3
  Top 0.254: MDBT42Q.18 24.65,20.25 25.9,19 25.9,3.7 25.3,3.1 24.4,3.1 23.95,3.55 R16.2 23.95,5.19 23.21,5.94 | R14.1 23.2,5.95 23.21,5.94 | 23.21,5.94 C8.1
BATTERY  (via drill 0.35)
  Top 0.254: MDBT42Q.8 12.17,14.83 13.6,13.4 v14.2,13.4
  Bottom 0.254: v14.2,13.4 15.5,13.4 18.53,16.43 C9.1 | R20.1 23.38,16.43 C9.1 | R19.1 22.5,16.83 C9.1
BJT
  Top 0.254: BJT.3 7.16,9.78 MICS6814.J 8.4,6.74 8.4,3.6 8.9,3.1 9.9,3.1 10.41,3.61 MICS6814.B
GND  (via drill 0.35, 0.35 pad 0.3)
  Top 0.254: LIS3DH.10 22.68,23.81 24.36,23.81 24.75,24.2 LIS3DH.5
  Bottom 0.254: VR_3.3.8 VR_3.3.7 VR_3.3.6 VR_3.3.5 | C5.1 30.63,19.3 VR_1.8.2 | C1.2 20.8,21.23 VR_5.1
  other vias: 35.54,23.56 28.45,16.65 33.1,10.4 24.66,29.4 20.3,13 8.6,23.6 9.6,22.5 8.7,21.6 9.7,20.6 8.7,19.6 9.7,18.6 8.7,17.6 7.7,18.6 6.7,17.6 5.7,18.6 35.9,18.7 26.5,16.9 25.1,16.6 26.1,23.2 23.4,17.4 32.2,16.1 21.6,23.2 13.6,21.2 14.6,19.9 13,19.1 15,18.6 11.6,18 19.2,35.2 12,20.3 11.8,21.7 12.7,23.4 14.6,22.7 11.1,23.4 31.3,16.9 36.2,17.1 36,20.9 30.6,21.6 19.4,10.9
  pour Top: 41,41 41,0 4.6,0.1 4.6,19.7 7.7,19.61 7.7,24.2 4.6,24.2 4.6,41 10.2,41 11.7,39.5 22.7,39.5 24.2,41
  pour Bottom: 4.6,0 41,0 41,41 24,41 22.6,39.6 11.6,39.6 10.3,40.9 4.6,40.9 4.6,24.3 7.7,24.3 7.7,19.6 4.6,19.6
LED  (via drill 0.35)
  Top 0.254: MDBT42Q.23 18.25,23.75 v18.4,23.9 | LED.+ 37.25,27.25 v35.77,25.77
  Bottom 0.254: v35.77,25.77 33.9,23.9 v18.4,23.9
N$2
  Bottom 0.254: BT2.S+1 4.39,1.95 5.04,1.3 18.3,1.3 18.99,1.99 BT2.S+2 18.99,8.35 22.54,11.9 28.1,11.9 30.14,9.86 BT1.-
N$3  (1 unrouted)
  Top 0.254: OPAMP.5 16.25,4.75 14.9,6.1 10,6.1 9.16,5.26
N$4
  Bottom 0.254: BT3.S+1 18.16,38.04 17.6,38.6 4.11,38.6 3.56,38.05 BT3.S+2 3.56,29.54 10.6,22.5 10.6,8 10.95,7.65 BT2.-
N$7
  Top 0.254: OPAMP.6 OPAMP.7 18.8,4.59 19.2,5 22.05,5 R14.2
N$8
  Top 0.254: OPAMP.2 OPAMP.1 20.07,9.23 20.3,9 22.15,9 R13.2
N$9
  Top 0.254: R18.2 LED.-
N$10
  Top 0.254: OPAMP.3 17.52,8.83 15.8,7.1 10,7.1 9.16,7.94 MICS6814.H
N$11
  Top 0.254: MICS6814.G 10.4,10.4 10.6,10.6 12.49,10.6 R12.1
N$13
  Top 0.254: R11.1 6.1,6.5 MICS6814.K
N$14
  Bottom 0.254: VR_3.3.4 28.18,18.28 27.7,17.8 C4.2
N$15
  Top 0.254: R17.2 9.74,12.79 9.55,12.98 BJT.1
N$17
  Top 0.152: MDBT42Q.13 19.3,16.75 CRYST.2 20.93,16.55 C12.2
N$18
  Top 0.152: CRYST.1 19.7,17.65 19.6,17.55 | 19.6,17.55 20.93,17.55 C13.2 | MDBT42Q.14 19.5,17.45 19.6,17.55
N$25
  Bottom 0.254: BT4.S+1 37.16,32.73 37.16,38.33 36.29,39.2 23.6,39.2 22.66,38.26 BT4.S+2 22.36,32.63 18.73,29 14,29 10.86,32.14 BT3.-
N$27
  Bottom 0.254: BT1.S+1 22.84,2.15 23.59,1.4 36.9,1.4 37.44,1.94 BT1.S+2 37.2,7.89 37.2,18.6 S1.2
P8
  Top 0.254: MDBT42Q.4 9.37,14.69 10.25,13.81 R17.1
SCL
  Top 0.15: 26,26.1 25.9,26.1
  Top 0.152: 27.58,15.58 R4.2 31,12.16 Q1.3 | 27.58,15.58 27.16,16 27.16,19 | 27.16,19 27.16,24.4 | 27.16,24.4 27.16,24.94 26,26.1 | Q4.2 23.46,27.66 R8.2 25.9,26.1 31,26.1 32.6,27.7 SCD41.9 | 27.16,19 25.21,20.95 MDBT42Q.19 | LIS3DH.4 26.46,23.7 27.16,24.4 | BME280.4 34.15,21 28.73,15.58 27.58,15.58
SCL5
  Top 0.152: Q4.3 22.04,29.31 19.53,29.31 R7.2 18.14,30.7 17.4,30.7 17.1,31 SPS30.3
SCL18
  Top 0.152: SGP30.6 31.13,5.74 R3.2 29.36,5.74 28.9,6.2 28.9,9.12 Q1.2
SDA  (via drill 0.35)
  Top 0.15: LIS3DH.6 24.26,24.47
  Top 0.152: 36.7,22 36.7,19.9 36.7,18.8 35.3,17.4 35.3,13.5 36.56,12.24 R6.1 36.56,9.75 Q2.3 | 36.7,22 36.7,23.6 35.3,25 31.9,25 | 31.9,25 v27.7,25 | MDBT42Q.21 18.6,22.35 19.9,23.65 19.9,26.1 | Q3.2 19.47,27.37 R10.1 19.9,26.1 | 19.9,26.1 20.8,25.2 23.67,25.2 | SCD41.10 33.85,26.95 31.9,25 | v24.8,25.2 23.67,25.2 | 24.26,24.47 24.26,24.61 23.67,25.2 | BME280.3 35.94,22.77 36.7,22
  Bottom 0.152: v27.7,25 25,25 v24.8,25.2
SDA5
  Top 0.15: 13.85,29.49 R9.1
  Top 0.152: SPS30.2 15.6,32.7 15.6,30.33 Q3.3 13.85,29.49
SDA18
  Top 0.152: SGP30.3 34.7,7.46 R5.1 35.2,7.96 36.88,7.96 37.89,6.95 Q2.2
SWDCLK
  Top 0.254: PROG.3 9.65,29.05 7.27,26.67 MDBT42Q.36
SWDIO
  Top 0.254: PROG.2 6.35,34.65 7.8,33.2 7.8,28.4 6.57,27.17 MDBT42Q.37
VDD
  Bottom 0.254: 29.1,22.6 36.9,22.6 37.4,22.1 S1.3 | 29.1,22.6 23.4,22.6 22.8,22 22.8,20.7 | VR_3.3.2 VR_3.3.1 28.18,21.68 29.1,22.6 | 22.8,20.7 22.8,19.45 R19.2 | 22.8,20.7 22.47,20.37 C1.1 20.71,20.37 VR_5.2

### Text on the board
tPlace: D | SPS30 | C
bPlace: ENVIRONMENTAL / WEARABLE / MONITOR | LARES 2022 | C4